# EAGLE design Safe motor control (EAGLE 5.11)
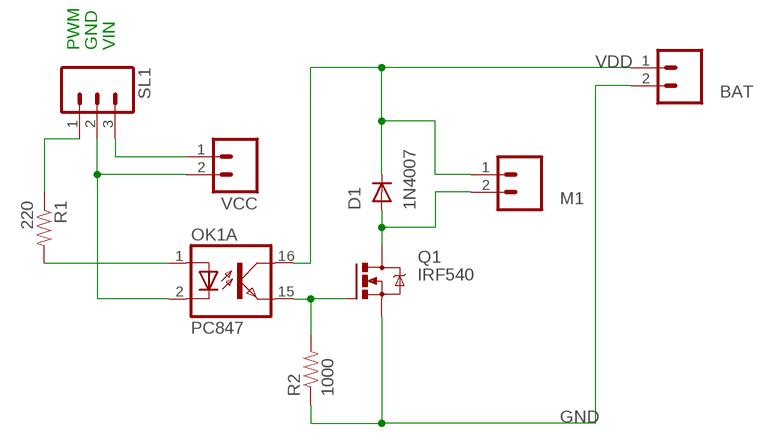
[diagram p0: schematic, sheet 1]

## Parts
BAT  M025MM  [SCREWTERMINAL-5MM-2]
D1  1N4007  DIODEPTH  [DIODE-1N4001]
M1  M025MM  [SCREWTERMINAL-5MM-2]
OK1  PC847  [DIL16]
Q1  IRF540  [TO220BV]
R1  220  RESISTORPTH1  [AXIAL-0.3]
R2  1000  RESISTORPTH1  [AXIAL-0.3]
SL1  M03  [03P]
VCC  M02PTH  [1X02]

## Nets
GND [power]: BAT.2 Q1.S R2.P$1
IN1: R1.P$1
M1- [power]: D1.A M1.2 Q1.D
N$1: OK1.1(A:A) R1.P$2
N$2: OK1.15(A:EMIT) Q1.G R2.P$2
N$5: SL1.3 VCC.1
VDD [power]: BAT.1 D1.C M1.1 OK1.16(A:COL)
VGND: OK1.2(A:C) SL1.2 VCC.2
Unconnected: OK1.3(B:A) OK1.4(B:C) OK1.5(C:A) OK1.6(C:C) OK1.7(D:A) OK1.8(D:C) OK1.9(D:EMIT) OK1.10(D:COL) OK1.11(C:EMIT) OK1.12(C:COL) OK1.13(B:EMIT) OK1.14(B:COL) SL1.1

## Notes on the sheet
- PWM | GND | VIN

## Library data of the parts
BAT M1 VCC = SparkFun:M02: Header 2 Standard 2-pin 0.1" header. Use with straight break away headers (SKU : PRT-00116), right angle break away headers (PRT-00553), swiss pins (PRT-00743), machine pins (PRT-00117), and female headers (PRT-00115). Molex polarized connector foot print use with SKU : PRT-08233 with associated crimp pins and housings.
D1 = SparkFun:DIODE: Diode These are standard reverse protection diodes and small signal diodes. SMA package can handle up to about 1A. SOD-323 can handle about 200mA. What the SOD-323 package when ordering, there are some mfgs out there that are 5-pin packages.
OK1 = optocoupler:PC847: SHARP OPTO COUPLER
Q1 = transistor-power:IRF540: HEXFET Power MOSFET
R1 R2 = SparkFun:RESISTOR: Resistor Basic schematic elements and footprints for 0603, 1206, and PTH 1/10th watt (small) resistors.
SL1 = con-amp-quick:M03: AMP QUICK CONNECTOR; OC_FARNELL: unknown; OC_NEWARK: unknown

## Net classes
1 power: width 1.524 mm, clearance 0.254 mm

## Board
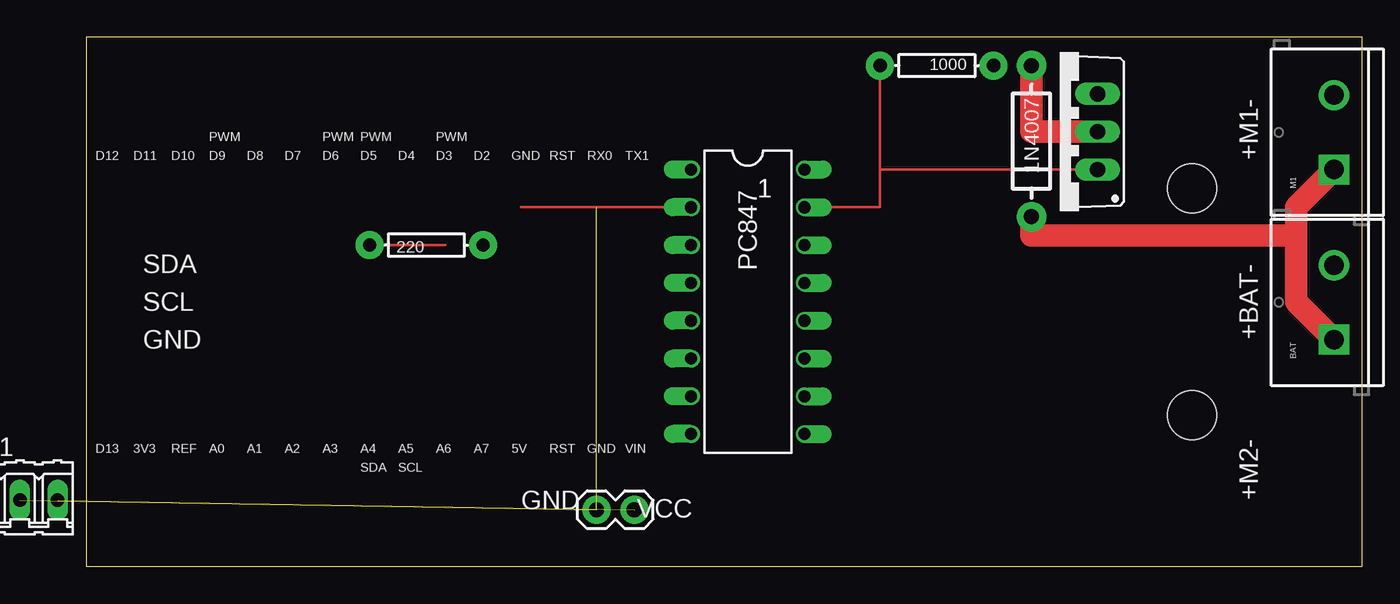
[diagram p1: board, top side]
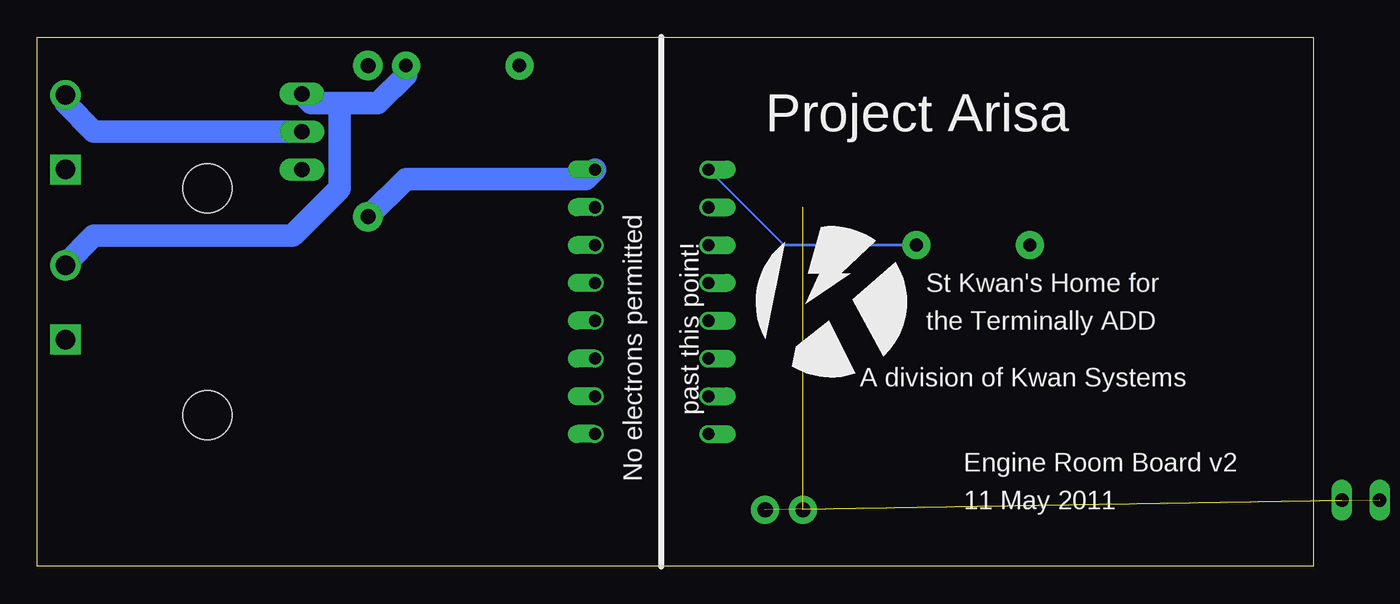
[diagram p2: board, bottom side, seen from below]

Size 85.72 x 35.56 mm. Coordinates in mm from the lower left corner, seen from the top.
Outline: 0,0 85.72,0 85.72,35.56 0,35.56 0,0
Copper layers (1*16): Top 0.0356mm / dielectric 1.5011mm / Bottom 0.0356mm
Design rules "LaenPCBOrder": minimum track width 6mil, minimum drill 13mil, track to track 6mil, track to pad 6mil, pad to pad 6mil, via to via 6mil, smd to smd 6mil, copper to edge 15mil, drill to drill 6mil, minimum pad ring 7mil, minimum via ring 7mil, stop-mask expansion 4mil, vias tented up to drill 0mil, thermal gap 10mil
tRestrict: area 41.9,0 to 47,35.6
bRestrict: area 41.9,0 to 47,35.6
vRestrict: area 29.8,15.2 to 34.9,20.3

### Footprints (pad centres in the part's own frame; a part is rotated, then mirrored left to right if it is on the bottom)
SCREWTERMINAL-5MM-2 = drill 1.3 pad 2.032 square: 1 0,0 | drill 1.3 pad 2.032 round: 2 5,0
DIODE-1N4001 = drill 1 pad 1.981 round: A -5.08,0; C 5.08,0
DIL16 = drill 0.813 offset: 1 -8.89,-3.81; 2 -6.35,-3.81; 3 -3.81,-3.81; 4 -1.27,-3.81; 5 1.27,-3.81; 6 3.81,-3.81; 7 6.35,-3.81; 8 8.89,-3.81; 9 8.89,3.81; 10 6.35,3.81; 11 3.81,3.81; 12 1.27,3.81; 13 -1.27,3.81; 14 -3.81,3.81; 15 -6.35,3.81; 16 -8.89,3.81
TO220BV = drill 1.016 long: D 0,-2.54; G -2.54,-2.54; S 2.54,-2.54
AXIAL-0.3 = drill 0.9 pad 1.88 round: P$1 -3.81,0; P$2 3.81,0
03P = drill 0.914 long: 1 -2.54,0; 2 0,0; 3 2.54,0
STAND-OFF = hole 3.302: 0,0
1X02 = drill 1.016 pad 1.88 round: 1 0,0; 2 2.54,0

### Placement (x,y rotation side)
BAT  83.82,15.24 90 top
D1  63.5,28.57 270 top
M1  83.82,26.67 90 top
OK1  44.45,17.78 270 top
Q1  65.41,29.21 90 top
R1  22.86,21.59 0 top
R2  57.15,33.66 180 top
SL1  -4.45,4.45 0 top
U$1  [STAND-OFF]  74.3,10.16 0 top
U$2  [STAND-OFF]  74.3,25.4 0 top
U$3  [KWAN_CIRCLE]  32.38,17.78 0 bottom
VCC  36.83,3.81 180 top

### Tracks (layer width: path | path; a pad name or v marks a point on that pad's centre or on a via)
GND
  Bottom 1.524: Q1.S 67.31,31.11 65.41,31.11 | 65.41,31.11 62.87,31.11 60.96,33.02 R2.P$1 | BAT.2 83.82,20.32 81.92,22.23 68.58,22.23 65.41,25.4 65.41,31.11
IN1
  Top 0.152: R1.P$1 24.13,21.59
M1-
  Top 1.524: Q1.D 63.5,29.21 D1.A
  Bottom 1.524: Q1.D 81.92,29.21 83.82,31.11 M1.2
N$1
  Bottom 0.152: OK1.1 35.56,21.59 R1.P$2
N$2
  Top 0.152: OK1.15 53.34,24.13 53.34,26.67 | 53.34,26.67 R2.P$2 | 53.34,26.67 Q1.G
N$5  (1 unrouted)
VDD
  Top 1.524: BAT.1 81.28,17.78 81.28,22.23 | 81.28,22.23 81.28,24.13 M1.1 | D1.C 63.5,22.23 81.28,22.23
  Bottom 1.524: OK1.16 48.9,26.04 60.96,26.04 D1.C
VGND  (2 unrouted)
  Top 0.152: 29.21,24.13 34.29,24.13 OK1.2

### Text on the board
tPlace: PWM | PWM | PWM | PWM | D12 | D11 | D10 | D9 | D8 | D7 | D6 | D5 | D4 | D3 | D2 | GND | RST | RX0 | TX1 | +M1- | 1 | SDA | SCL | GND | +BAT- | D13 | 3V3 | REF | A0 | A1 | A2 | A3 | A4 | A5 | A6 | A7 | 5V | RST | GND | VIN | SDA | SCL | GND | +M2-
bPlace: Project Arisa | St Kwan's Home for | the Terminally ADD | A division of Kwan Systems | past this point! | Engine Room Board v2 | No electrons permitted | 11 May 2011